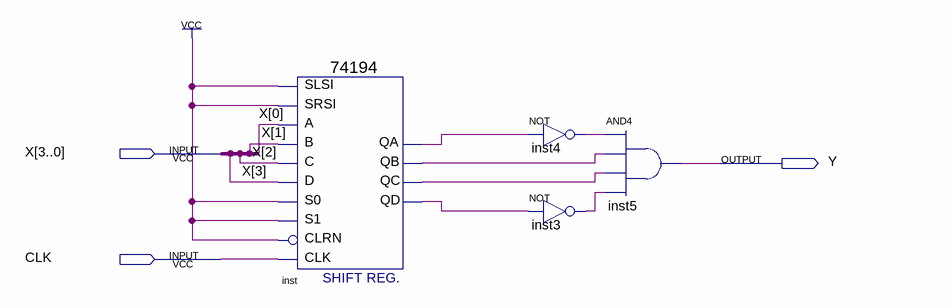
[diagram p0: schematic sheet]
// Quartus schematic DetSeq.bdf as structural Verilog: 4 symbols, 3 pins
module DetSeq (
  input  [3:0] X,
  input  CLK,
  output Y
);

  wire inst3_out, inst4_out, inst_qa, inst_qb, inst_qc, inst_qd;

  \74194  inst (
    .SLSI(1'b1), .SRSI(1'b1), .B(X[1]), .C(X[2]), .CLK(CLK), .CLRN(1'b1), .D(X[3]), .S1(1'b1), .S0(1'b1),
    .A(X[0]), .QA(inst_qa), .QB(inst_qb), .QC(inst_qc), .QD(inst_qd));
  not inst4 (inst4_out, inst_qa);
  not inst3 (inst3_out, inst_qd);
  and inst5 (Y, inst4_out, inst_qb, inst_qc, inst3_out);
endmodule
